# Altium project PCB_Project_1.PrjPcb
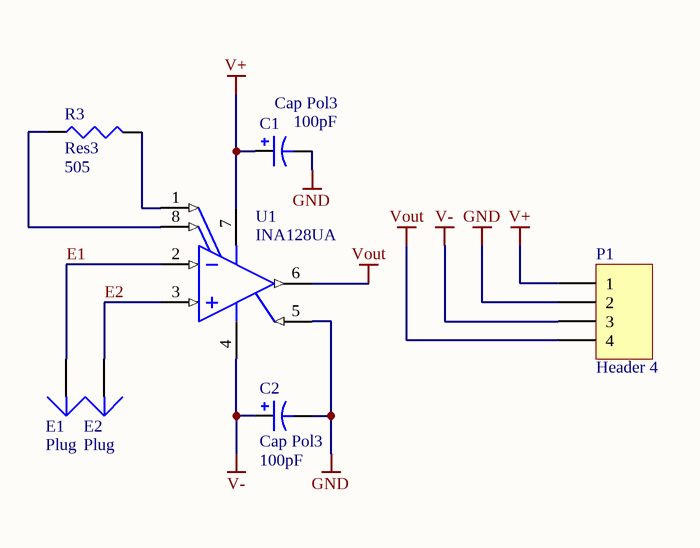
[diagram p0: PreAmp.SchDoc]
1 sheet, 7 parts. Net scope: global (net labels, ports and power ports of the same name join across sheets).
Board file: PreAmp.PcbDoc

## Sheet PreAmp.SchDoc
size A4

### Parts
C1  Cap Pol3  value 100pF  [C0805]
C2  Cap Pol3  value 100pF  [C0805]
E1  Plug  [PIN1]
E2  Plug  [PIN1]
P1  Header 4  [HDR1X4]
R3  Res3  value 505  [J1-0603]
U1  INA128UA  [TI-D8_N]

### Nets
GND: C1.2 C2.2 P1.2 U1.5(REF)
V+: C1.1 P1.1 U1.7(V+)
V-: C2.1 P1.3 U1.4(V-)
Vout: P1.4 U1.6(VO)
E1: E1.1 U1.2(VIN-)
E2: E2.1 U1.3(VIN+)
NetR3_1: R3.1 U1.8(RG)
NetR3_2: R3.2 U1.1(RG)

### Library data of the parts
C1 C2 = Cap Pol3: Polarized Capacitor (Surface Mount); Published: 8-Jun-2000; LatestRevisionDate: 29-May-2009; LatestRevisionNote: IPC-7351 Footprint Added.; PackageReference: C0805; Publisher: Altium Limited; PackageDescription: Chip Capacitor
P1 = Header 4: Header, 4-Pin; LatestRevisionDate: 17-Jul-2002; LatestRevisionNote: Re-released for DXP Platform.; Publisher: Altium Limited
R3 = Res3: Resistor; Published: 8-Jun-2000; LatestRevisionDate: 29-May-2009; LatestRevisionNote: IPC-7351 Footprint Added.; PackageReference: J1-0603; Publisher: Altium Limited; PackageDescription: Chip Resistor
U1 = INA128UA: Precision, Low Power Instrumentation Amplifier, -40 to 85 degC, 8-pin SOIC (D8), Green (RoHS & no Sb/Br); Manufacturer: Texas Instruments; CMRR(Min)(dB): 110; Gain(V/V): 1 to 10000; Input Bias Current (+/-)(Max)(nA): 10; Input Offset (+/-)(Max)(uV): 125; Input Offset Drift (+/-)(Max)(uV/Degrees Celsius): 1; Noise at 1kHz(Typ)(nV/rt(Hz)): 8; Non-Linearity (+/-)(Max)(%): 0.004; Quiescent Current (+/-)(Typ)(mA): 0.7; SubFamily: Dual Supply; Vs(Max)(V): 36; Vs(Min)(V): 4.5; DatasheetVersion: SBOS051B; PackageVersion: 4040047-3/M, 06/2011; PackageReference: D8; PackageDescription: 8-Pin Plastic Small Outline, Body 4.9 x 3.9 mm, Pitch 1.27 mm; Supplier 1: Digi-Key; Supplier Part Number 1: INA128UA-ND; Supplier 2: Newark; Supplier Part Number 2: 35C1730; Supplier 3: Mouser; Supplier Part Number 3: 595-INA128UA; Eco-Plan: Green (RoHS & no Sb/Br); Number of Channels: 1; Mounting Technology: Surface Mount; Code_JEDEC: MS-012; PartNumber: INA128UA; ComponentLink1Description: Manufacturer URL; ComponentLink1URL: http://www.ti.com/; ComponentLink2Description: Datasheet; ComponentLink2URL: http://www.ti.com/general/docs/lit/getliterature.tsp?genericPartNumber=INA128&fileType=pdf; ComponentLink3Description: Package Specification; ComponentLink3URL: http://www.ti.com/litv/pdf/msoi002j
E1 E2 = Plug: LatestRevisionDate: 17-Jul-2002; LatestRevisionNote: Re-released for DXP Platform.; Publisher: Altium Limited